# Altium project SIM800L_Adapter.PrjPcb
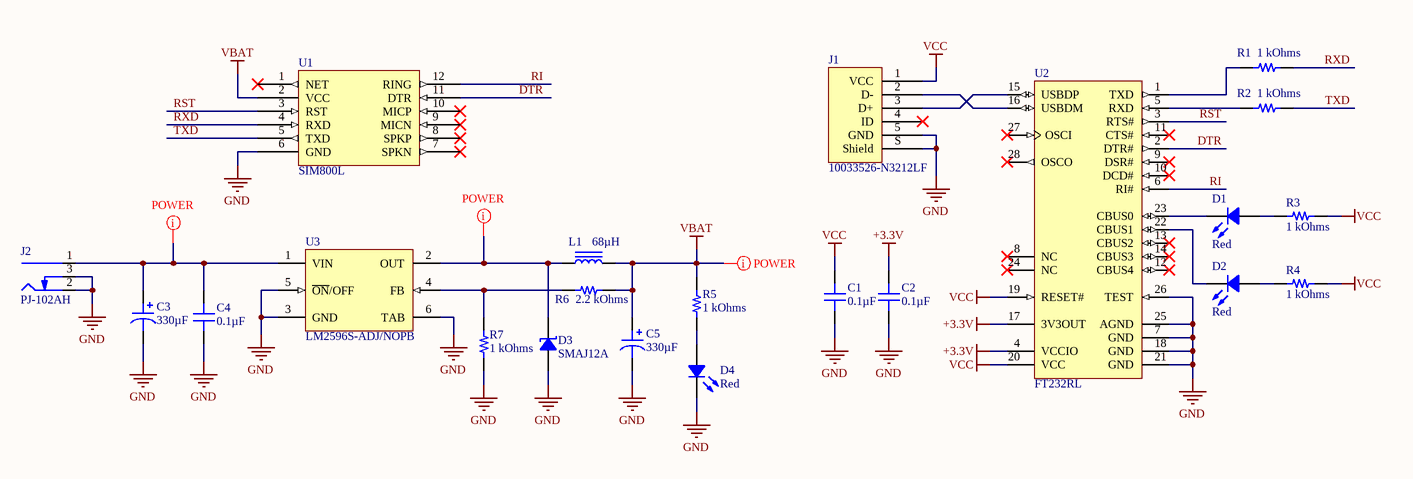
[diagram p0: SIM800L.SchDoc]
1 sheet, 22 parts. Net scope: global (net labels, ports and power ports of the same name join across sheets).
Board file: PCB.PcbDoc

## Sheet SIM800L.SchDoc
size A4

### Parts
C1  0.1µF  [CAP 0805_2012]
C2  0.1µF  [CAP 0805_2012]
C3  330µF  [CAP AL TH D8 L3.5 H12.5]
C4  0.1µF  [CAP 0805_2012]
C5  330µF  [CAP AL TH D8 L3.5 H12.5]
D1  Red  [LED 1206_3216 RED]
D2  Red  [LED 1206_3216 RED]
D3  SMAJ12A  [DO214AC SMA]
D4  Red  [LED 1206_3216 RED]
J1  10033526-N3212LF  [FCI USB 10033526-N3212LF]
J2  PJ-102AH  [CUI PJ-102AH]
L1  68µH  [TDK SLF12575]
R1  1 kOhms  [RES 0805_2012]
R2  1 kOhms  [RES 0805_2012]
R3  1 kOhms  [RES 0805_2012]
R4  1 kOhms  [RES 0805_2012]
R5  1 kOhms  [RES 0805_2012]
R6  2.2 kOhms  [RES 0805_2012]
R7  1 kOhms  [RES 0805_2012]
U1  SIM800L  [SIM800L]
U2  FT232RL  [FTDI-SSOP-28_M]
U3  LM2596S-ADJ/NOPB  [TO263-5]

### Nets
+3.3V: C2.2 U2.4(VCCIO) U2.17(3V3OUT)
GND: C1.1 C2.1 C3.2 C4.1 C5.2 D3.1 D4.2 J1.5(GND) J1.S(Shield) J2.2(Outer) J2.3(SW) R7.1 U1.6(GND) U2.7(GND) U2.18(GND) U2.21(GND) U2.25(AGND) U2.26(TEST) U3.3(GND) U3.5(~{ON}/OFF) U3.6(TAB)
VBAT: C5.1 L1.2 R5.2 R6.2 U1.2(VCC)
VCC: C1.2 J1.1(VCC) R3.1 R4.1 U2.19(RESET#) U2.20(VCC)
DTR: U1.11(DTR) U2.2(DTR#)
RI: U1.12(RING) U2.6(RI#)
RST: U1.3(RST) U2.3(RTS#)
RXD: R1.1 U1.4(RXD)
TXD: R2.1 U1.5(TXD)
NetC3_1: C3.1 C4.2 J2.1(Centre) U3.1(VIN)
NetD1_1: D1.1 R3.2
NetD1_2: D1.2 U2.23(CBUS0)
NetD2_1: D2.1 R4.2
NetD2_2: D2.2 U2.22(CBUS1)
NetD3_2: D3.2 L1.1 U3.2(OUT)
NetD4_1: D4.1 R5.1
NetJ1_2: J1.2(D-) U2.16(USBDM)
NetJ1_3: J1.3(D+) U2.15(USBDP)
NetR1_2: R1.2 U2.1(TXD)
NetR2_2: R2.2 U2.5(RXD)
NetR6_1: R6.1 R7.2 U3.4(FB)

Not connected (* = marked no-connect by the designer): J1 4(ID)*; U1 1(NET)* 7(SPKN)* 8(SPKP)* 9(MICN)* 10(MICP)*; U2 8(NC)* 9(DSR#)* 10(DCD#)* 11(CTS#)* 12(CBUS4)* 13(CBUS2)* 14(CBUS3)* 24(NC)* 27(OSCI)* 28(OSCO)*

### Layout directives
net class POWER: NetC3_1, NetD3_2, VBAT

### Library data of the parts
C1 C2 C4 = AC0805KKX8R9BB104: CAP CER 0805 10% X8R 50V 100NF; Manufacturer: Yageo; Part Number: AC0805KKX8R9BB104; Value: 0.1µF; Applications: Automotive; Capacitance: 0.1µF; ComponentLink1Description: Datasheet; ComponentLink1URL: http://www.yageo.com/documents/recent/AC0805KKX8R9BB104.pdf; ComponentLink2Description: DigiKey Link; ComponentLink2URL: http://digikey.com/product-detail/en/yageo/AC0805KKX8R9BB104/311-4624-1-ND/9699550; Device Package: 0805 (2012 Metric); LastUpdated: 1/21/2020 12:02:48 AM; Lifecycle Status: Active; Minimum Order: 1; Mounting Type: Surface Mount, MLCC; Operating Temperature: -55°C ~ 150°C; Package / Case: 0805 (2012 Metric); Packaging: TapeAndReel; PartId: 14076; Part Status: Active; Price: 0.06; Ratings: AEC-Q200; Series: AC; Size / Dimension: 0.079" L x 0.049" W (2.00mm x 1.25mm); Supplier 1: DigiKey; Supplier Part Number 1: 311-4624-1-ND; Temperature Coefficient: X8R; Thickness (Max): 0.057" (1.45mm); Tolerance: ±10%; Voltage - Rated: 50V
C3 C5 = ECA-1EHG331: CAP ALUM 330UF 20% 25V RADIAL; Manufacturer: Panasonic Electronic Components; COLUMN1: 1000 Hrs @ 105°C; Polarization: Polar; Ripple Current @ High Frequency: 465mA @ 100kHz; Ripple Current @ Low Frequency: 310mA @ 120Hz; Part Number: ECA-1EHG331; Applications: General Purpose; Capacitance: 330µF; ComponentLink1Description: Datasheet; ComponentLink1URL: http://industrial.panasonic.com/www-cgi/jvcr13pz.cgi?E+PZ+3+ABA0026+ECA1EHG331+7+WW; ComponentLink2Description: DigiKey Link; ComponentLink2URL: http://digikey.com/product-detail/en/panasonic-electronic-components/ECA-1EHG331/P5542-ND/245141; Device Package: Radial, Can; Height - Seated (Max): 0.492" (12.50mm); LastUpdated: 1/21/2020 3:40:51 AM; Lead Spacing: 0.138" (3.50mm); Lifecycle Status: Active; Minimum Order: 1; Mounting Type: Through Hole; Operating Temperature: -55°C ~ 105°C; Package / Case: Radial, Can; Packaging: Bulk; PartId: 7313; Part Status: Active; Price: 0.49; Series: NHG; Size / Dimension: 0.315" Dia (8.00mm); Supplier 1: DigiKey; Supplier Part Number 1: P5542-ND; Tolerance: ±20%; Value: 330µF; Voltage - Rated: 25V
D1 D2 D4 = EASR3216RA0: LED RED CLEAR 2SMD; Manufacturer: Everlight Electronics Co Ltd; Configuration: Standard; Current - Test: 5mA; Lens Color: Colorless; Lens Size: 1.40mm x 1.60mm; Lens Style: Rectangle with Flat Top; Millicandela Rating: 27mcd; Viewing Angle: 130°; Voltage - Forward (Vf) (Typ): 1.85V; Wavelength - Dominant: 626nm; Wavelength - Peak: 632nm; Part Number: EASR3216RA0; Color: Red; ComponentLink1Description: Datasheet; ComponentLink1URL: https://everlightamericas.com/index.php?controller=attachment&id_attachment=2591; ComponentLink2Description: DigiKey Link; ComponentLink2URL: http://digikey.com/product-detail/en/everlight-electronics-co-ltd/EASR3216RA0/1080-EASR3216RA0CT-ND/11201000; Device Package: 1206 (3216 Metric); Height (Max): 1.10mm; LastUpdated: 1/21/2020 3:14:28 AM; Lens Transparency: Clear; Lifecycle Status: Active; Minimum Order: 1; Mounting Type: Surface Mount; Package / Case: 1206 (3216 Metric); Packaging: TapeAndReel; PartId: 948; Part Status: Active; Price: 0.07; Series: -; Size / Dimension: 3.20mm L x 1.60mm W; Supplier 1: DigiKey; Supplier Part Number 1: 1080-EASR3216RA0CT-ND; Supplier Device Package: 2-SMD; Value: Red
D3 = SMAJ12A: TVS DIODE 12V 19.9V DO214AC; Manufacturer: Littelfuse Inc.; Current - Peak Pulse (10/1000µs): 20.1A; Power Line Protection: No; Power - Peak Pulse: 400W; Type: Zener; Unidirectional Channels: 1; Voltage - Breakdown (Min): 13.3V; Part Number: SMAJ12A; Applications: General Purpose; ComponentLink1Description: Datasheet; ComponentLink1URL: https://www.littelfuse.com/~/media/electronics/datasheets/tvs_diodes/littelfuse_tvs_diode_smaj_datasheet.pdf.pdf; ComponentLink2Description: DigiKey Link; ComponentLink2URL: http://digikey.com/product-detail/en/littelfuse-inc/SMAJ12A/SMAJ12ALFCT-ND/762482; Device Package: DO-214AC, SMA; LastUpdated: 3/21/2020 12:56:27 AM; Lifecycle Status: Active; Minimum Order: 1; Mounting Type: Surface Mount; Operating Temperature: -65°C ~ 150°C (TJ); Package / Case: DO-214AC, SMA; Packaging: TapeAndReel; PartId: 5712; Part Status: Active; Price: 0.09; Series: SMAJ; Supplier 1: DigiKey; Supplier Part Number 1: SMAJ12ALFCT-ND; Supplier Device Package: DO-214AC (SMA); Voltage - Clamping (Max) @ Ipp: 19.9V; Voltage - Reverse Standoff (Typ): 12V
J1 = 10033526-N3212LF: CONN RCPT MINI USB B 5POS SMD RA; Manufacturer: Amphenol ICC (FCI); Connector Type: USB - mini B; Current Rating (Amps): 1A per Contact; Gender: Receptacle; Mating Cycles: 5000; Number of Contacts: 5; Number of Ports: 1; Shielding: Shielded; Voltage - Rated: 30V; Part Number: 10033526-N3212LF; ComponentLink1Description: Datasheet; ComponentLink1URL: http://www.amphenol-icc.com/media/wysiwyg/files/drawing/10033526.pdf; ComponentLink2Description: DigiKey Link; ComponentLink2URL: //digikey.com/product-detail/en/amphenol-icc-fci/10033526-N3212LF/609-4700-2-ND/4292074; Features: Board Guide, Solder Retention; LastUpdated: 12/9/2019 8:52:14 PM; Lifecycle Status: 0; Minimum Order: 1; Mounting Feature: Horizontal; Mounting Type: Surface Mount, Right Angle; Operating Temperature: -25°C ~ 85°C; Packaging: TapeAndReel; Part Status: Active; Price: 0.39; Series: -; Supplier 1: DigiKey; Supplier Part Number 1: 609-4700-2-ND; Termination: Solder
J2 = PJ-102AH: CONN PWR JACK 2X5.5MM SOLDER; Manufacturer: CUI Devices; Actual Diameter: 0.079" (2.00mm ID), 0.256" (6.50mm OD); Current Rating (Amps): 5A; Gender: Male; Industry Recognized Mating Diameter: 2.00mm ID (0.079"), 5.50mm OD (0.217"); Internal Switch(s): Single Switch, Normally Closed; Material Flammability Rating: UL94 V-0; Mating Length/Depth: 0.354" (9.00mm); Number of Positions/Contacts: 2 Conductors, 3 Contacts; Shielding: Unshielded; Voltage - Rated: 24VDC; Part Number: PJ-102AH; ComponentLink1Description: Datasheet; ComponentLink1URL: https://www.cuidevices.com/product/resource/digikeypdf/pj-102ah.pdf; ComponentLink2Description: DigiKey Link; ComponentLink2URL: //digikey.com/product-detail/en/cui-devices/PJ-102AH/CP-102AH-ND/408448; Connector Type: Jack; LastUpdated: 12/16/2019 7:01:27 PM; Lifecycle Status: 0; Minimum Order: 1; Mounting Type: Through Hole, Right Angle; Packaging: Tray; Part Status: Active; Price: 0.76; Series: -; Supplier 1: DigiKey; Supplier Part Number 1: CP-102AH-ND; Termination: Solder
L1 = SLF12575T-680M2R0-PF: FIXED IND 68UH 2A 77.8 MOHM SMD; Manufacturer: TDK Corporation; Current Rating (Amps): 2.4A; Inductance Frequency - Test: 1kHz; Material - Core: Ferrite; Shielding: Shielded; Tolerance: ±20%; Type: Wirewound; Part Number: SLF12575T-680M2R0-PF; ComponentLink1Description: Datasheet; ComponentLink1URL: https://product.tdk.com/info/en/catalog/datasheets/inductor_commercial_power_slf12575_en.pdf?ref_disty=digikey; ComponentLink2Description: DigiKey Link; ComponentLink2URL: http://digikey.com/product-detail/en/tdk-corporation/SLF12575T-680M2R0-PF/445-181397-1-ND/9740675; Current - Saturation: 2A; DC Resistance (DCR): 77.8mOhm; Device Package: Nonstandard; Height - Seated (Max): 0.309" (7.85mm); Inductance: 68µH; LastUpdated: 1/21/2020 3:26:04 AM; Lifecycle Status: Active; Minimum Order: 1; Mounting Type: Surface Mount; Operating Temperature: -40°C ~ 105°C; Package / Case: Nonstandard; Packaging: TapeAndReel; PartId: 130; Part Status: Active; Price: 0.94; Series: SLF; Size / Dimension: 0.492" L x 0.492" W (12.50mm x 12.50mm); Supplier 1: DigiKey; Supplier Part Number 1: 445-181397-1-ND; Value: 68µH
R1-R5 R7 = ERJ-6GEYJ102V: RES SMD 1K OHM 5% 1/8W 0805; Manufacturer: Panasonic Electronic Components; Power (Watts): 0.125W, 1/8W; Temperature Coefficient: ±200ppm/°C; Part Number: ERJ-6GEYJ102V; Value: 1 kOhms; ComponentLink1Description: Datasheet; ComponentLink1URL: http://industrial.panasonic.com/www-cgi/jvcr13pz.cgi?E+PZ+3+AOA0001+ERJ6GEYJ102V+7+WW; ComponentLink2Description: DigiKey Link; ComponentLink2URL: http://digikey.com/product-detail/en/panasonic-electronic-components/ERJ-6GEYJ102V/P1.0KACT-ND/42833; Composition: Thick Film; Device Package: 0805 (2012 Metric); Features: Automotive AEC-Q200; Height - Seated (Max): 0.028" (0.70mm); LastUpdated: 1/21/2020 1:39:37 AM; Lifecycle Status: Active; Minimum Order: 1; Number of Terminations: 2; Operating Temperature: -55°C ~ 155°C; Package / Case: 0805 (2012 Metric); Packaging: TapeAndReel; PartId: 48781; Part Status: Active; Price: 0.01; Ratings: AEC-Q200; Resistance: 1 kOhms; Series: ERJ; Size / Dimension: 0.079" L x 0.049" W (2.00mm x 1.25mm); Supplier 1: DigiKey; Supplier Part Number 1: P1.0KACT-ND; Supplier Device Package: 0805; Tolerance: ±5%
R6 = ERJ-P06J222V: RES SMD 2.2K OHM 5% 1/2W 0805; Manufacturer: Panasonic Electronic Components; Power (Watts): 0.5W, 1/2W; Temperature Coefficient: ±200ppm/°C; Part Number: ERJ-P06J222V; Value: 2.2 kOhms; ComponentLink1Description: Datasheet; ComponentLink1URL: https://industrial.panasonic.com/cdbs/www-data/pdf/RDO0000/AOA0000C331.pdf; ComponentLink2Description: DigiKey Link; ComponentLink2URL: http://digikey.com/product-detail/en/panasonic-electronic-components/ERJ-P06J222V/P2.2KADCT-ND/525478; Composition: Thick Film; Device Package: 0805 (2012 Metric); Features: Automotive AEC-Q200, Pulse Withstanding; Height - Seated (Max): 0.028" (0.70mm); LastUpdated: 1/21/2020 1:44:38 AM; Lifecycle Status: Active; Minimum Order: 1; Number of Terminations: 2; Operating Temperature: -55°C ~ 155°C; Package / Case: 0805 (2012 Metric); Packaging: TapeAndReel; PartId: 39925; Part Status: Active; Price: 0.01; Ratings: AEC-Q200; Resistance: 2.2 kOhms; Series: ERJ; Size / Dimension: 0.079" L x 0.049" W (2.00mm x 1.25mm); Supplier 1: DigiKey; Supplier Part Number 1: P2.2KADCT-ND; Supplier Device Package: 0805; Tolerance: ±5%
U2 = CMP-2000-05029-1: IC USB FS SERIAL UART 28-SSOP; Manufacturer: FTDI; Receive FIFO: 256B; Number of Channels per Chip: 1; Maximum Data Rate: 3MBd; Transmit FIFO: 128B; Dimensions: 10.2x5.3x1.75mm; Mounting Type: SurfaceMount; Height: 1.75mm; Package Type: SSOP; Datasheet Version: Rev. 1.04, 02/2006; Width: 5.3mm; Manufacturer URL: http://www.ftdichip.com/; Datasheet URL: http://datasheet.octopart.com/FT232RL-FTDI-datasheet-120501.pdf; Maximum Operating Temperature: +85degC; Minimum Operating Temperature: -40degC; Pin Count: 28; Length: 10.2mm
U3 = LM2596S-ADJ/NOPB: SIMPLE SWITCHER® Power Converter 150 KHz 3A Step-Down Voltage Regulator, 5-pin TO-263, Pb-Free; Manufacturer: Texas Instruments; PowerWise: N; PackageTopMarking: NSUZXYTTE#*LM2596S*-ADJ P+; ComponentLink1Description: Datasheet URL; PackageDescription: TO-263, Molded, .400 x .390 x .180in, 5 Lead, .067in Pitch, Surface Mount; ComponentLink1URL: http://www.ti.com/general/docs/lit/getliterature.tsp?genericPartNumber=LM2596&fileType=pdf; Code_JEDEC: MO-169-AB; PinCount: 5; CompType: Switcher; PackageReference: KTT0005B; RoHS: Y